# EAGLE design IOIO Sensors Homemade (EAGLE 5.11)
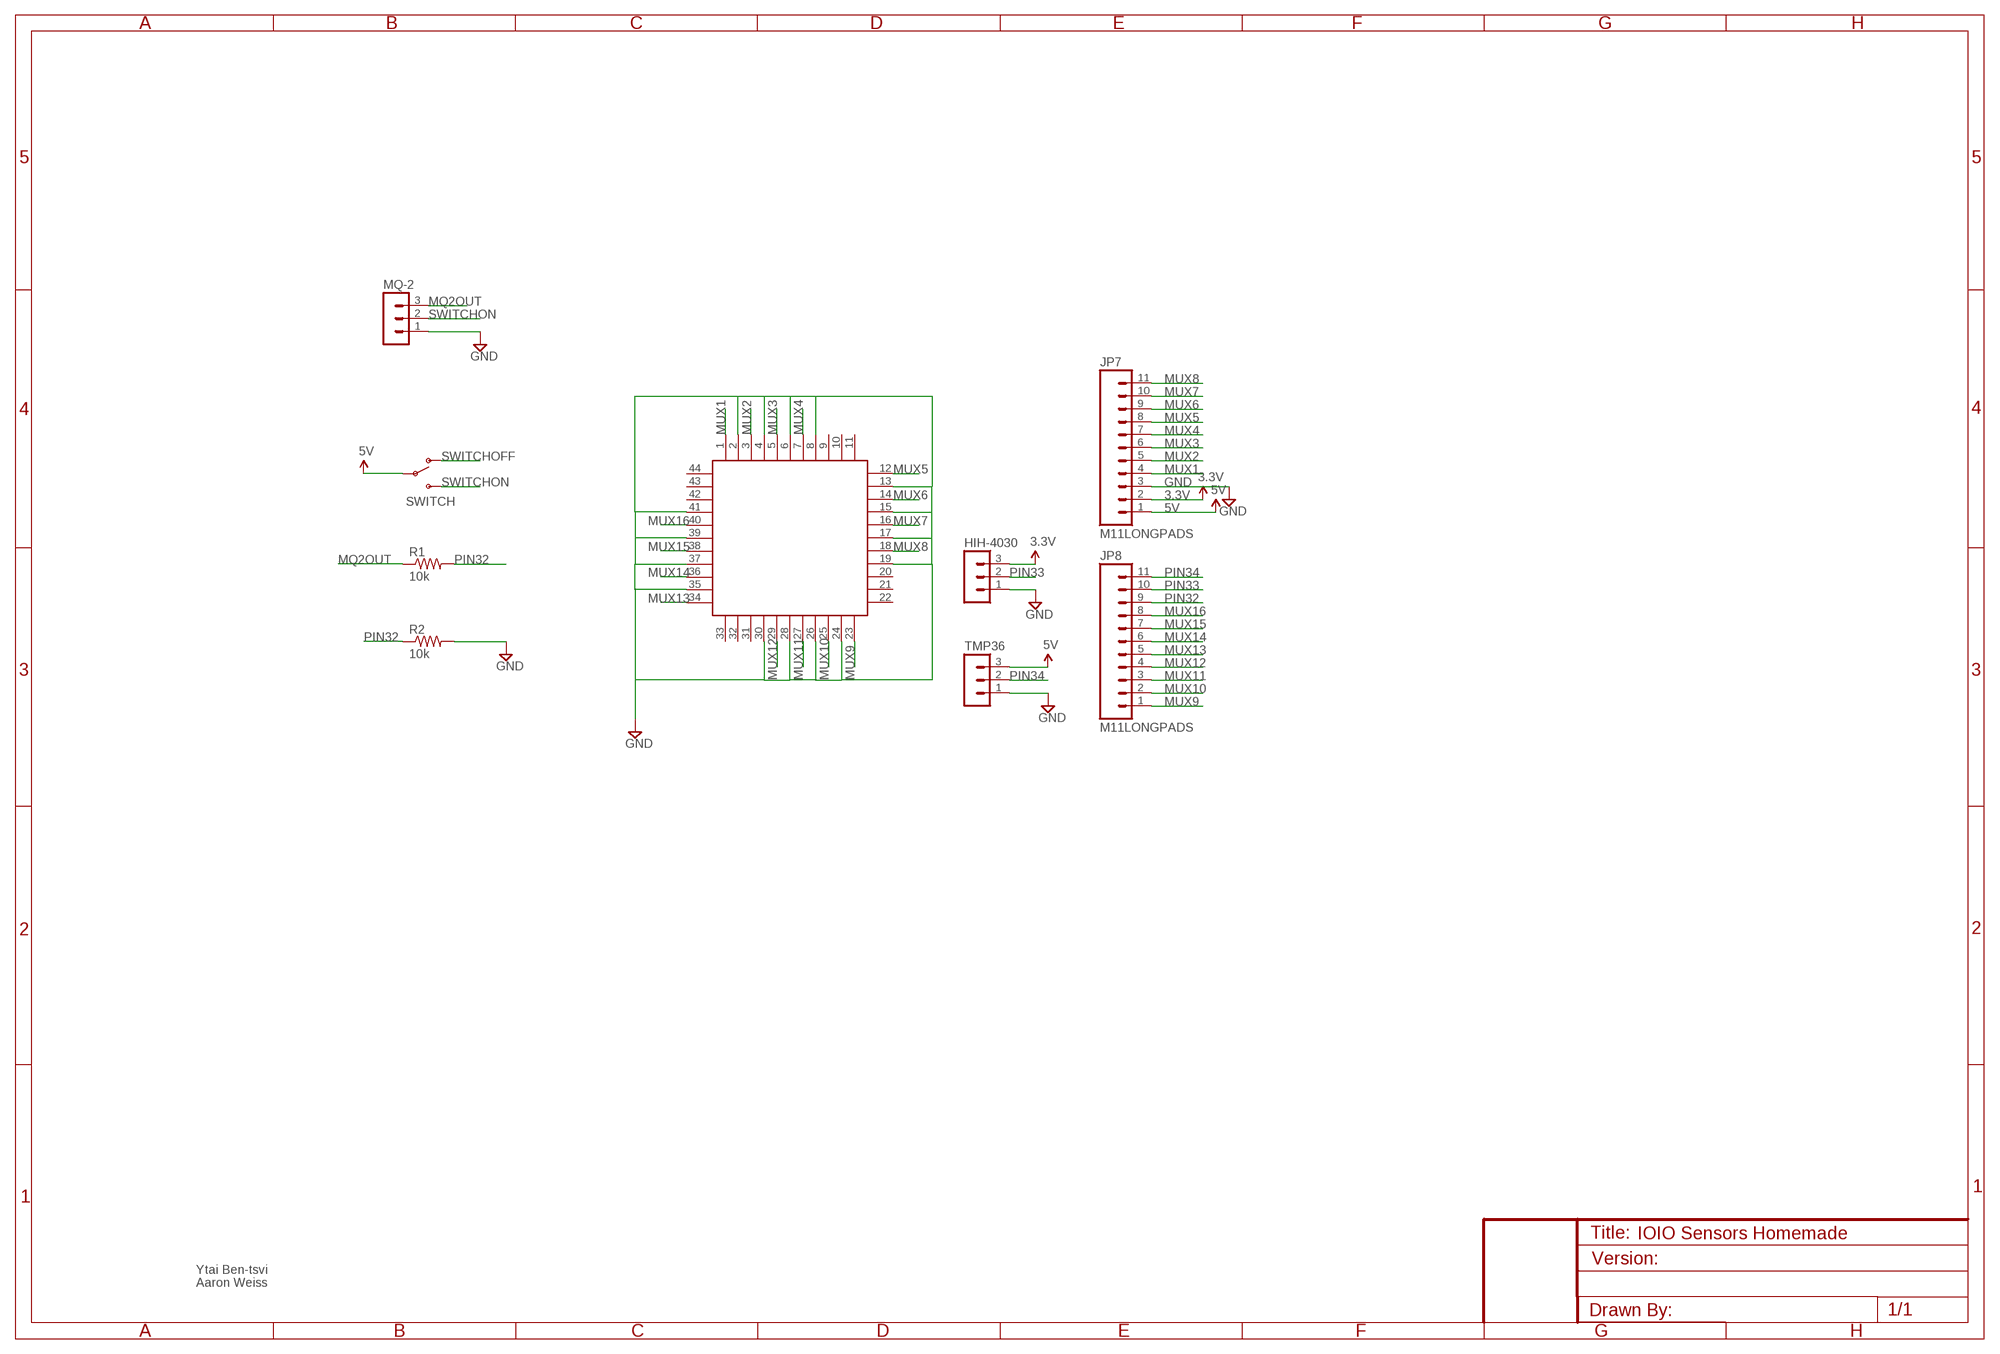
[diagram p0: schematic, sheet 1]

## Parts
HIH-4030  MA03-1  [MA03-1]
JP7  M11LONGPADS  [1X11_LONGPADS]
JP8  M11LONGPADS  [1X11_LONGPADS]
MQ-2  MA03-1  [MA03-1]
R1  10k  R-US_0207/7  [0207/7]
R2  10k  R-US_0207/7  [0207/7]
SWITCH  SWITCH-SPSTPTH_LOCK  [SWITCH-SPDT_LOCK.007S]
TMP36  MA03-1  [MA03-1]
U$4  S44  [S44]

## Nets
3.3V: HIH-4030.3 JP7.2
5V: JP7.1 SWITCH.2(P) TMP36.3
GND: HIH-4030.1 JP7.3 MQ-2.1 R2.2 TMP36.1 U$4.2 U$4.4 U$4.6 U$4.8 U$4.13 U$4.15 U$4.17 U$4.19 U$4.24 U$4.26 U$4.28 U$4.30 U$4.35 U$4.37 U$4.39 U$4.41
MQ2OUT: MQ-2.3 R1.1
MUX1: JP7.4 U$4.1
MUX2: JP7.5 U$4.3
MUX3: JP7.6 U$4.5
MUX4: JP7.7 U$4.7
MUX5: JP7.8 U$4.12
MUX6: JP7.9 U$4.14
MUX7: JP7.10 U$4.16
MUX8: JP7.11 U$4.18
MUX9: JP8.1 U$4.23
MUX10: JP8.2 U$4.25
MUX11: JP8.3 U$4.27
MUX12: JP8.4 U$4.29
MUX13: JP8.5 U$4.34
MUX14: JP8.6 U$4.36
MUX15: JP8.7 U$4.38
MUX16: JP8.8 U$4.40
PIN32: JP8.9 R1.2 R2.1
PIN33: HIH-4030.2 JP8.10
PIN34: JP8.11 TMP36.2
SWITCHOFF: SWITCH.1(O)
SWITCHON: MQ-2.2 SWITCH.3(S)
Unconnected: U$4.9 U$4.10 U$4.11 U$4.20 U$4.21 U$4.22 U$4.31 U$4.32 U$4.33 U$4.42 U$4.43 U$4.44

## Notes on the sheet
- Ytai Ben-tsvi
- Aaron Weiss

## Library data of the parts
HIH-4030 MQ-2 TMP36 = con-lstb:MA03-1: PIN HEADER; OC_FARNELL: unknown; OC_NEWARK: unknown
JP7 JP8 = SparkFun:M11: Header 11 Standard 11-pin 0.1" header. Use with straight break away headers (SKU : PRT-00116), right angle break away headers (PRT-00553), swiss pins (PRT-00743), machine pins (PRT-00117), and female headers (PRT-00115).
R1 R2 = resistor:R-US_: RESISTOR, American symbol
SWITCH = SparkFun:SWITCH-SPST: SPST Switch Simple slide switch. Spark Fun Electronics SKU : COM-00102
U$4 = plcc-socket:S44: 44-pin PLCC through-hole socket

## Board
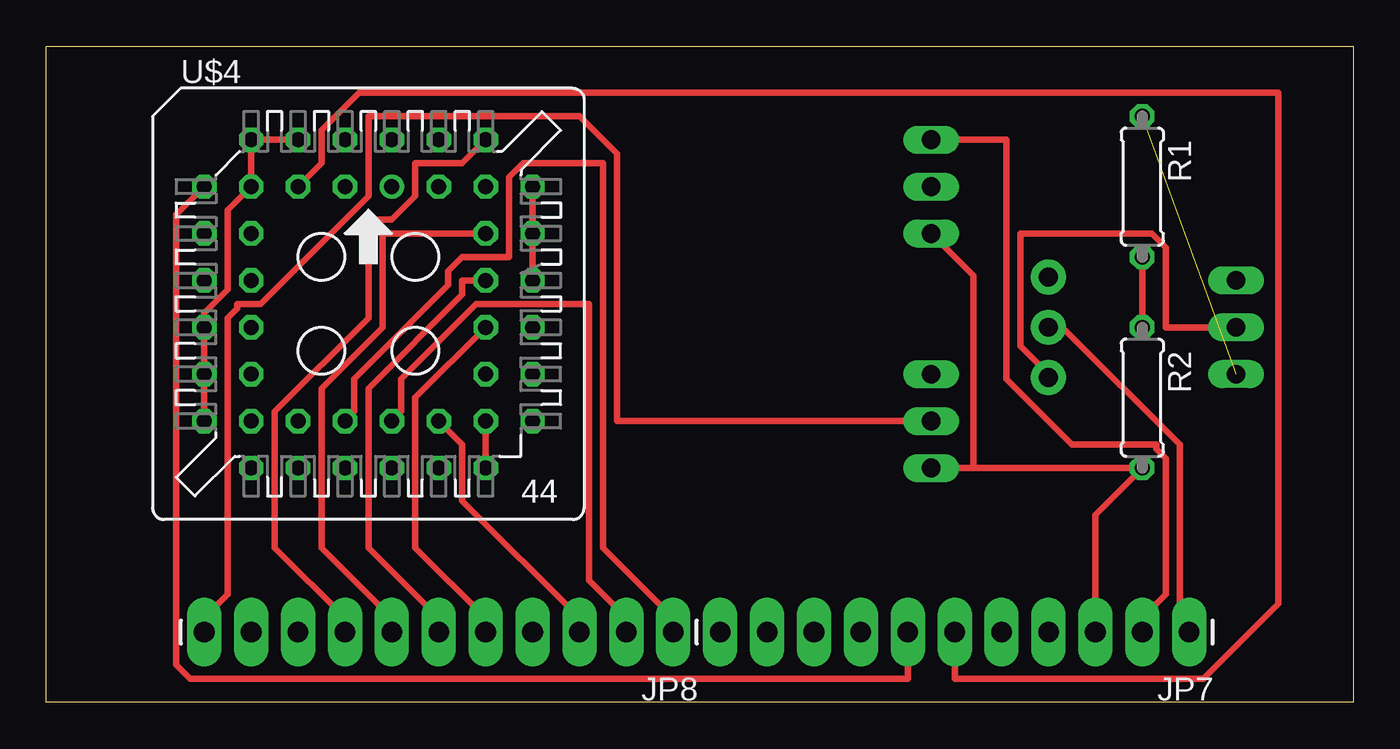
[diagram p1: board, top side]
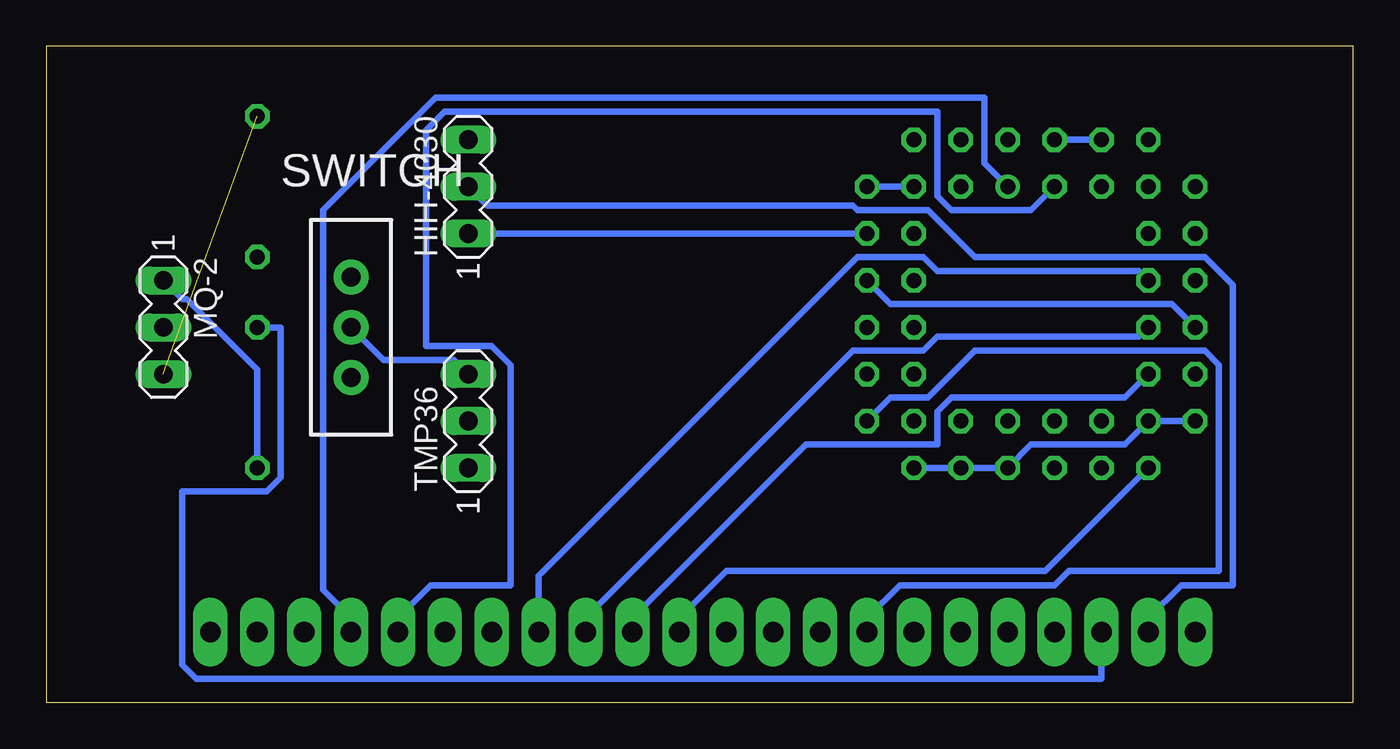
[diagram p2: board, bottom side, seen from below]

Size 70.79 x 35.55 mm. Coordinates in mm from the lower left corner, seen from the top.
Outline: 70.79,0 0,0 0,35.55 70.79,35.55 70.79,0
Copper layers (1*16): Top 0.035mm / dielectric 1.5mm / Bottom 0.035mm
Design rules "default *": minimum track width 14mil, minimum drill 24mil, track to track 16mil, track to pad 16mil, pad to pad 16mil, via to via 16mil, smd to smd 16mil, copper to edge 40mil, drill to drill 8mil, minimum pad ring 10mil, minimum via ring 8mil, stop-mask expansion 4mil, vias tented up to drill 0mil, thermal gap 10mil

### Footprints (pad centres in the part's own frame; a part is rotated, then mirrored left to right if it is on the bottom)
MA03-1 = drill 1.016 long: 1 -2.54,0; 2 0,0; 3 2.54,0
1X11_LONGPADS = drill 1.118 pad 1.88 long: 1 0,0; 2 2.54,0; 3 5.08,0; 4 7.62,0; 5 10.16,0; 6 12.7,0; 7 15.24,0; 8 17.78,0; 9 20.32,0; 10 22.86,0; 11 25.4,0
0207/7 = drill 0.813 octagon: 1 -3.81,0; 2 3.81,0
SWITCH-SPDT_LOCK.007S = drill 1.016 pad 1.88 round: 1 0,2.718; 2 0,0; 3 0,-2.718
S44 = drill 0.813 round: 1 1.27,6.35 | drill 0.813 octagon: 2 -1.27,8.89; 3 -1.27,6.35; 4 -3.81,8.89; 5 -3.81,6.35; 6 -6.35,8.89; 7 -8.89,6.35; 8 -6.35,6.35; 9 -8.89,3.81; 10 -6.35,3.81; 11 -8.89,1.27; 12 -6.35,1.27; 13 -8.89,-1.27; 14 -6.35,-1.27; 15 -8.89,-3.81; 16 -6.35,-3.81; 17 -8.89,-6.35; 18 -6.35,-8.89; 19 -6.35,-6.35; 20 -3.81,-8.89; 21 -3.81,-6.35; 22 -1.27,-8.89; 23 -1.27,-6.35; 24 1.27,-8.89; 25 1.27,-6.35; 26 3.81,-8.89; 27 3.81,-6.35; 28 6.35,-8.89; 29 8.89,-6.35; 30 6.35,-6.35; 31 8.89,-3.81; 32 6.35,-3.81; 33 8.89,-1.27; 34 6.35,-1.27; 35 8.89,1.27; 36 6.35,1.27; 37 8.89,3.81; 38 6.35,3.81; 39 8.89,6.35; 40 6.35,8.89; 41 6.35,6.35; 42 3.81,8.89; 43 3.81,6.35; 44 1.27,8.89

### Placement (x,y rotation side)
HIH-4030  47.93,27.94 90 bottom
JP7  61.9,3.81 180 top
JP8  33.96,3.81 180 top
MQ-2  64.44,20.32 270 bottom
R1  59.36,27.94 270 top
R2  59.36,16.51 270 top
SWITCH  54.28,20.32 0 bottom
TMP36  47.93,15.24 90 bottom
U$4  17.45,21.59 0 top

### Tracks (layer width: path | path; a pad name or v marks a point on that pad's centre or on a via)
3.3V
  Top 0.356: HIH-4030.3 51.99,30.48 51.99,17.53 55.55,13.97 60.12,13.97 60.12,13.72 60.63,13.21 60.63,5.84 59.36,4.57 JP7.2
5V
  Top 0.356: JP7.1 61.39,4.32 61.39,13.97 55.04,20.32 SWITCH.2
  Bottom 0.356: TMP36.3 48.69,18.54 52.5,18.54 SWITCH.2
GND
  Top 0.356: U$4.4 U$4.6 U$4.8 9.83,26.67 9.83,22.35 8.56,21.08 U$4.13 U$4.15 U$4.17 | U$4.28 U$4.30 | U$4.35 U$4.37 U$4.39 | JP7.3 56.82,10.16 R2.2 50.22,12.7 | 50.22,12.7 TMP36.1 | HIH-4030.1 50.22,23.11 50.22,12.7
  Bottom 0.356: U$4.4 U$4.2 | U$4.17 U$4.19 12.37,13.97 17.45,13.97 U$4.24 U$4.26 U$4.28 | U$4.39 U$4.41 | MQ-2.1 63.42,21.84 63.17,21.84 59.36,18.03 R2.2 | U$4.37 HIH-4030.1 | U$4.13 9.83,21.59 25.07,21.59 U$4.35
MQ2OUT  (1 unrouted)
MUX1
  Bottom 0.356: U$4.1 19.99,29.21 19.99,32.77 49.71,32.77 55.8,26.67 55.8,6.1 54.28,4.57 JP7.4
MUX2
  Bottom 0.356: U$4.3 17.45,26.67 21.77,26.67 22.53,27.43 22.53,32 49.2,32 50.22,30.99 50.22,19.3 46.66,19.3 45.64,18.29 45.64,6.35 49.96,6.35 51.74,4.57 JP7.5
MUX3
  Top 0.356: U$4.5 14.91,29.21 14.91,30.99 16.94,33.02 66.73,33.02 66.73,5.33 62.66,1.27 49.2,1.27 JP7.6
MUX4
  Top 0.356: U$4.7 7.04,26.42 7.04,2.03 7.8,1.27 46.66,1.27 JP7.7
MUX5
  Bottom 0.356: U$4.12 11.61,23.37 22.53,23.37 23.29,24.13 26.85,24.13 44.12,6.86 JP7.8
MUX6
  Bottom 0.356: U$4.14 11.61,19.81 22.53,19.81 23.29,19.05 27.1,19.05 41.58,4.57 JP7.9
MUX7
  Bottom 0.356: U$4.16 12.37,16.51 21.77,16.51 22.53,15.75 22.53,13.97 29.64,13.97 39.04,4.57 JP7.10
MUX8
  Bottom 0.356: U$4.18 16.69,7.11 33.96,7.11 36.5,4.57 JP7.11
MUX9
  Top 0.356: U$4.23 16.69,15.75 16.69,17.53 21.77,22.61 21.77,23.37 22.53,24.13 25.07,24.13 25.07,28.45 25.83,29.21 30.15,29.21 30.15,8.38 33.96,4.57 JP8.1
MUX10
  Top 0.356: U$4.25 19.23,15.75 19.23,17.53 23.29,21.59 29.39,21.59 29.39,6.6 31.42,4.57 JP8.2
MUX11
  Top 0.356: U$4.27 22.53,13.97 22.53,10.92 28.88,4.57 JP8.3
MUX12
  Bottom 0.356: U$4.29 25.07,16.51 23.04,16.51 20.5,19.05 8.05,19.05 7.29,18.29 7.29,7.11 15.42,7.11 16.18,6.35 24.56,6.35 26.34,4.57 JP8.4
MUX13
  Top 0.356: U$4.34 19.99,16.51 19.99,8.38 23.8,4.57 JP8.5
MUX14
  Top 0.356: U$4.36 22.53,22.86 22.53,22.1 17.45,17.02 17.45,8.38 21.26,4.57 JP8.6
MUX15
  Top 0.356: U$4.38 18.21,25.4 18.21,20.32 14.91,17.02 14.91,8.38 18.72,4.57 JP8.7
MUX16
  Top 0.356: U$4.40 22.53,29.21 19.99,29.21 19.99,27.43 18.72,26.16 17.45,26.16 17.45,20.83 12.37,15.75 12.37,8.38 16.18,4.57 JP8.8
PIN32
  Top 0.356: R2.1 R1.2
  Bottom 0.356: JP8.9 13.64,1.27 62.66,1.27 63.42,2.03 63.42,11.43 58.85,11.43 58.09,12.19 58.09,20.32 R2.1
PIN33
  Bottom 0.356: HIH-4030.2 46.91,26.92 27.1,26.92 26.85,26.67 23.04,26.67 20.5,24.13 8.05,24.13 6.53,22.61 6.53,6.35 9.32,6.35 11.1,4.57 JP8.10
PIN34
  Top 0.356: TMP36.2 30.91,15.24 30.91,29.72 28.88,31.75 17.45,31.75 17.45,27.43 11.61,21.59 10.34,21.59 10.34,21.34 9.83,20.83 9.83,5.84 8.56,4.57 JP8.11
SWITCHON
  Top 0.356: MQ-2.2 60.63,20.32 60.63,24.64 59.87,25.4 52.76,25.4 52.76,19.3 54.28,17.78 SWITCH.3